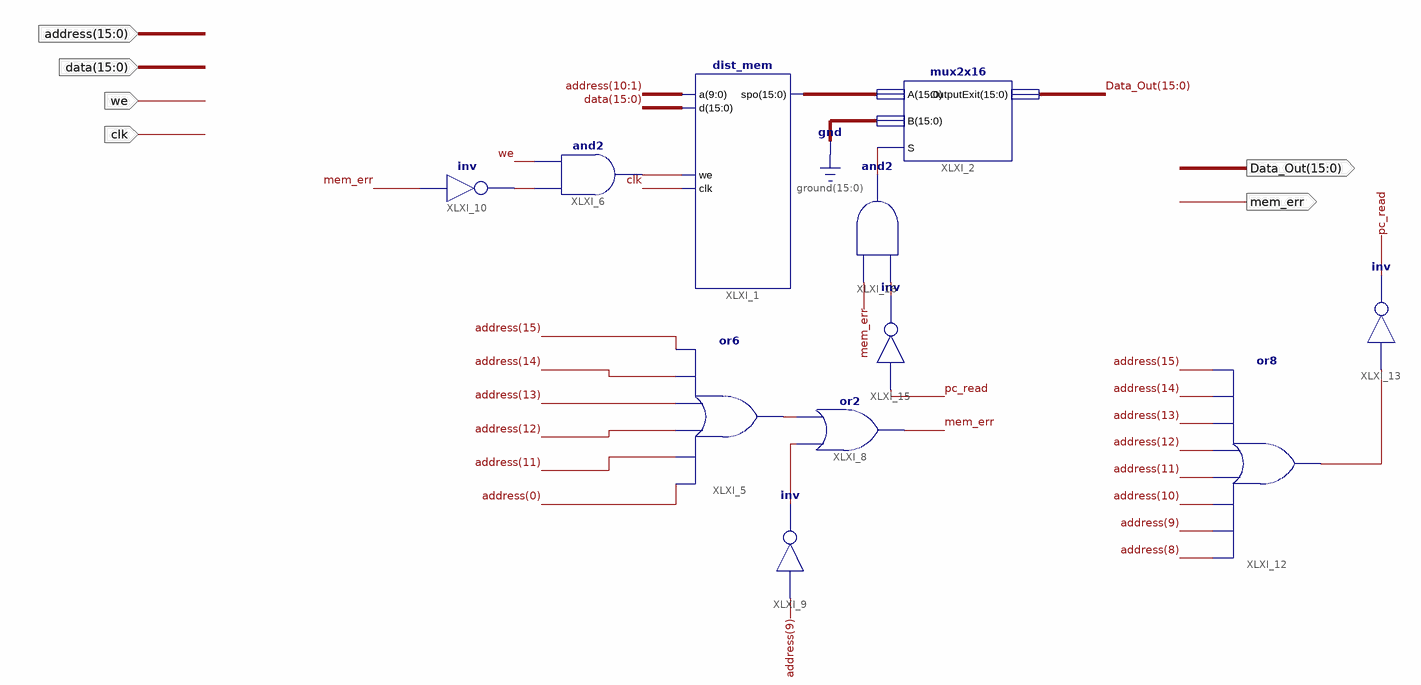
[diagram p0: schematic sheet 1]
// Xilinx ISE schematic Memory.sch (spartan3e) as structural Verilog: 11 symbols, 7 ports
module Memory (
  input  [15:0] address,
  input  [15:0] data,
  input  we,
  input  clk,
  output mem_err,
  output [15:0] Data_Out
);

  wire pc_read, XLXN_39, XLXN_40, XLXN_45, XLXN_46, XLXN_59, XLXN_61, XLXN_62;
  wire [15:0] XLXN_22;

  dist_mem XLXI_1 (.a(address[10:1]), .d(data), .we(XLXN_45), .clk(clk), .spo(XLXN_22));
  mux2x16 XLXI_2 (.A(XLXN_22), .B({16{1'b0}}), .S(XLXN_61), .OutputExit(Data_Out));
  or XLXI_5 (XLXN_39, address[0], address[11], address[12], address[13], address[14], address[15]);
  and XLXI_6 (XLXN_45, XLXN_46, we);
  or XLXI_8 (mem_err, XLXN_40, XLXN_39);
  not XLXI_9 (XLXN_40, address[9]);
  not XLXI_10 (XLXN_46, mem_err);
  or XLXI_12 (XLXN_59, address[8], address[9], address[10], address[11], address[12], address[13], address[14], address[15]);
  not XLXI_13 (pc_read, XLXN_59);
  not XLXI_15 (XLXN_62, pc_read);
  and XLXI_16 (XLXN_61, XLXN_62, mem_err);
endmodule
